# EAGLE design top_lcd_splice (EAGLE 6.5.0)
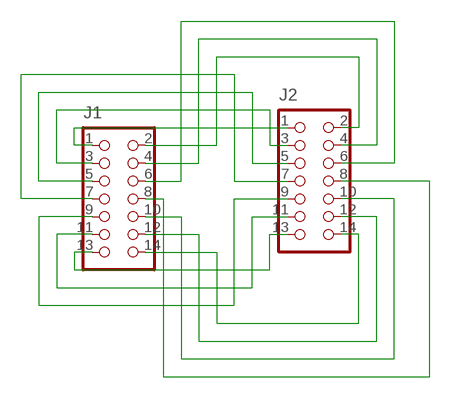
[diagram p0: schematic, sheet 1]

## Parts
J1  CON_HEADER_2X07-PTH-SHROUDED  [PINSHRD_PTH_2X07]
J2  CON_HEADER_2X07-PTH-SHROUDED  [PINSHRD_PTH_2X07]

## Nets
GND: J1.1 J2.1
N$2: J1.3 J2.3
N$3: J1.5 J2.5
N$4: J1.7 J2.7
N$5: J1.9 J2.9
N$6: J1.11 J2.11
N$7: J1.13 J2.13
N$9: J1.4 J2.4
N$10: J1.6 J2.6
N$11: J1.14 J2.14
N$12: J1.12 J2.12
N$13: J1.10 J2.10
N$14: J1.8 J2.8
VCC: J1.2 J2.2

## Library data of the parts
J1 J2 = dp_devices:CON_HEADER_2X07: 2x07 pin header

## Board
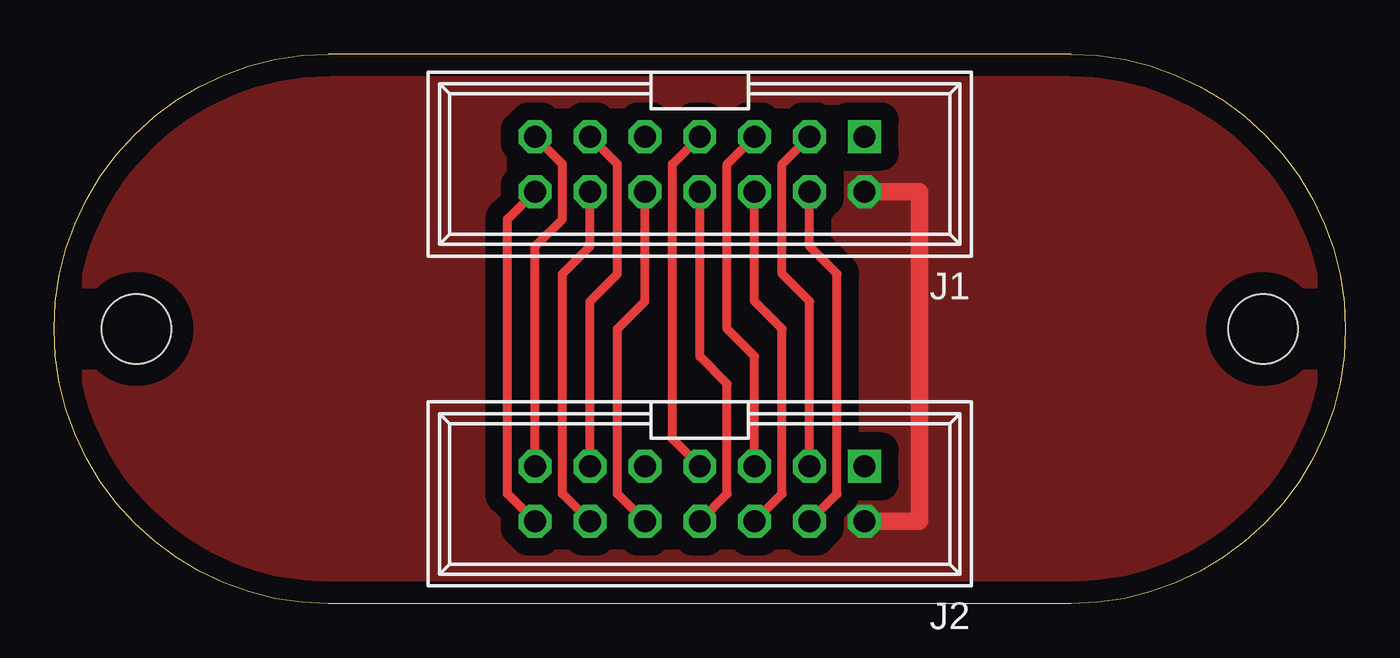
[diagram p1: board, top side]
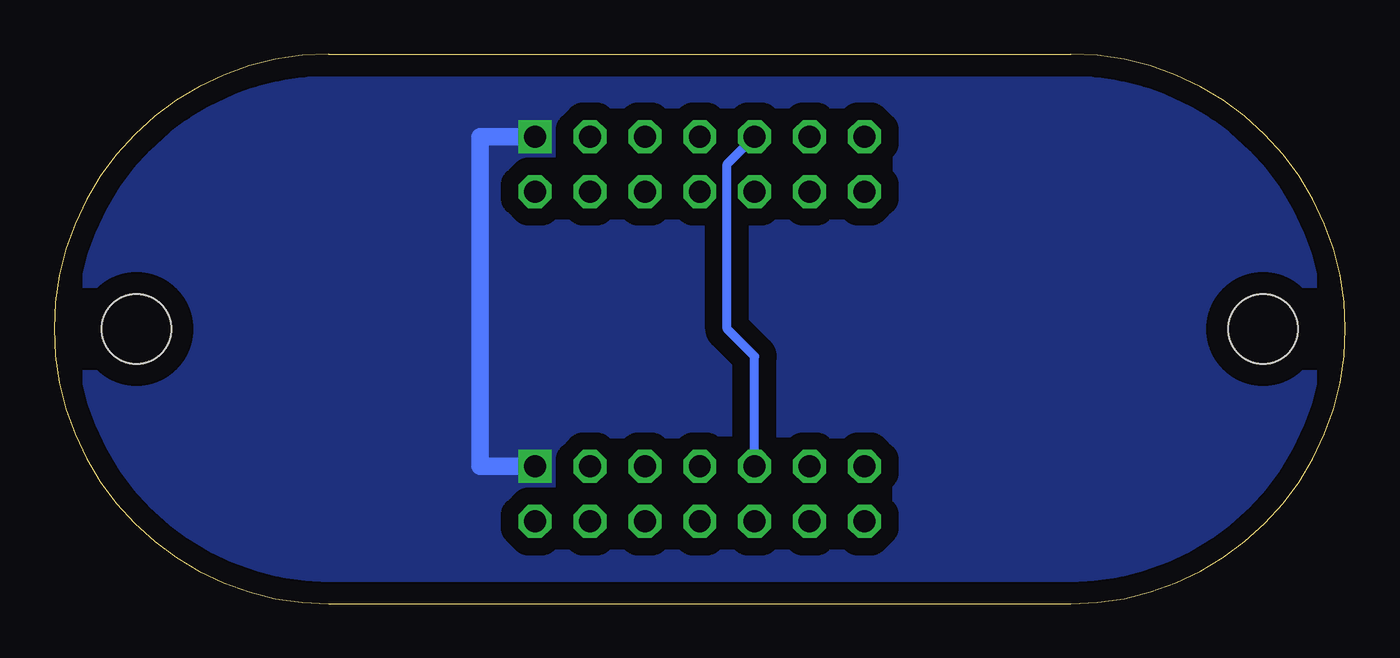
[diagram p2: board, bottom side, seen from below]

Size 59.69 x 25.4 mm. Coordinates in mm from the lower left corner, seen from the top.
Outline: 46.99,25.4 arc-180 46.99,0 12.7,0 arc-180 12.7,25.4 46.99,25.4
Copper layers (1*16): Top 0.035mm / dielectric 1.5mm / Bottom 0.035mm
Design rules "default": minimum track width 10mil, minimum drill 24mil, track to track 8mil, track to pad 8mil, pad to pad 8mil, via to via 8mil, smd to smd 8mil, copper to edge 40mil, drill to drill 8mil, minimum pad ring 10mil, minimum via ring 8mil, stop-mask expansion 4mil, vias tented up to drill 0mil, thermal gap 10mil
Holes 3.2 mm at 55.88,12.7 3.81,12.7

### Footprints (pad centres in the part's own frame; a part is rotated, then mirrored left to right if it is on the bottom)
PINSHRD_PTH_2X07 = drill 1.016 square: 1 -7.62,-1.27 | drill 1.016 octagon: 2 -7.62,1.27; 3 -5.08,-1.27; 4 -5.08,1.27; 5 -2.54,-1.27; 6 -2.54,1.27; 7 0,-1.27; 8 0,1.27; 9 2.54,-1.27; 10 2.54,1.27; 11 5.08,-1.27; 12 5.08,1.27; 13 7.62,-1.27; 14 7.62,1.27

### Placement (x,y rotation side)
J1  29.84,20.32 180 top
J2  29.84,5.08 180 top

### Tracks (layer width: path | path; a pad name or v marks a point on that pad's centre or on a via)
GND
  Bottom 0.813: J2.1 40,6.35 40,21.59 J1.1
  pour Bottom (isolate 0.813, no thermals): 59.69,0 -1.27,0 -1.27,25.4 59.69,25.4
N$2
  Top 0.406: J2.3 34.92,13.97 33.65,15.24 33.65,20.32 J1.3
N$3
  Top 0.406: J2.5 32.38,11.43 31.11,12.7 31.11,20.32 J1.5
N$4
  Top 0.406: J2.7 28.57,7.62 28.57,20.32 J1.7
N$5
  Bottom 0.406: J2.9 27.3,11.43 28.57,12.7 28.57,20.32 J1.9
N$6
  Top 0.406: J2.11 24.77,13.97 26.03,15.24 26.03,20.32 J1.11
N$7
  Top 0.406: J2.13 22.23,16.51 23.49,17.78 23.49,20.32 J1.13
N$9
  Top 0.406: J2.4 36.2,5.08 36.2,15.24 34.92,16.51 J1.4
N$10
  Top 0.406: J2.6 33.65,5.08 33.65,12.7 32.38,13.97 J1.6
N$11
  Top 0.406: J2.14 20.95,5.08 20.95,17.78 J1.14
N$12
  Top 0.406: J2.12 23.49,5.08 23.49,15.24 24.77,16.51 J1.12
N$13
  Top 0.406: J2.10 26.03,5.08 26.03,12.7 27.3,13.97 J1.10
N$14
  Top 0.406: J2.8 31.11,5.08 31.11,10.16 29.84,11.43 J1.8
VCC
  Top 0.813: J2.2 40,3.81 40,19.05 J1.2
  pour Top (isolate 0.813, no thermals): 59.69,0 -1.27,0 -1.27,25.4 59.69,25.4